# Altium project AX5243_module.PrjPcb
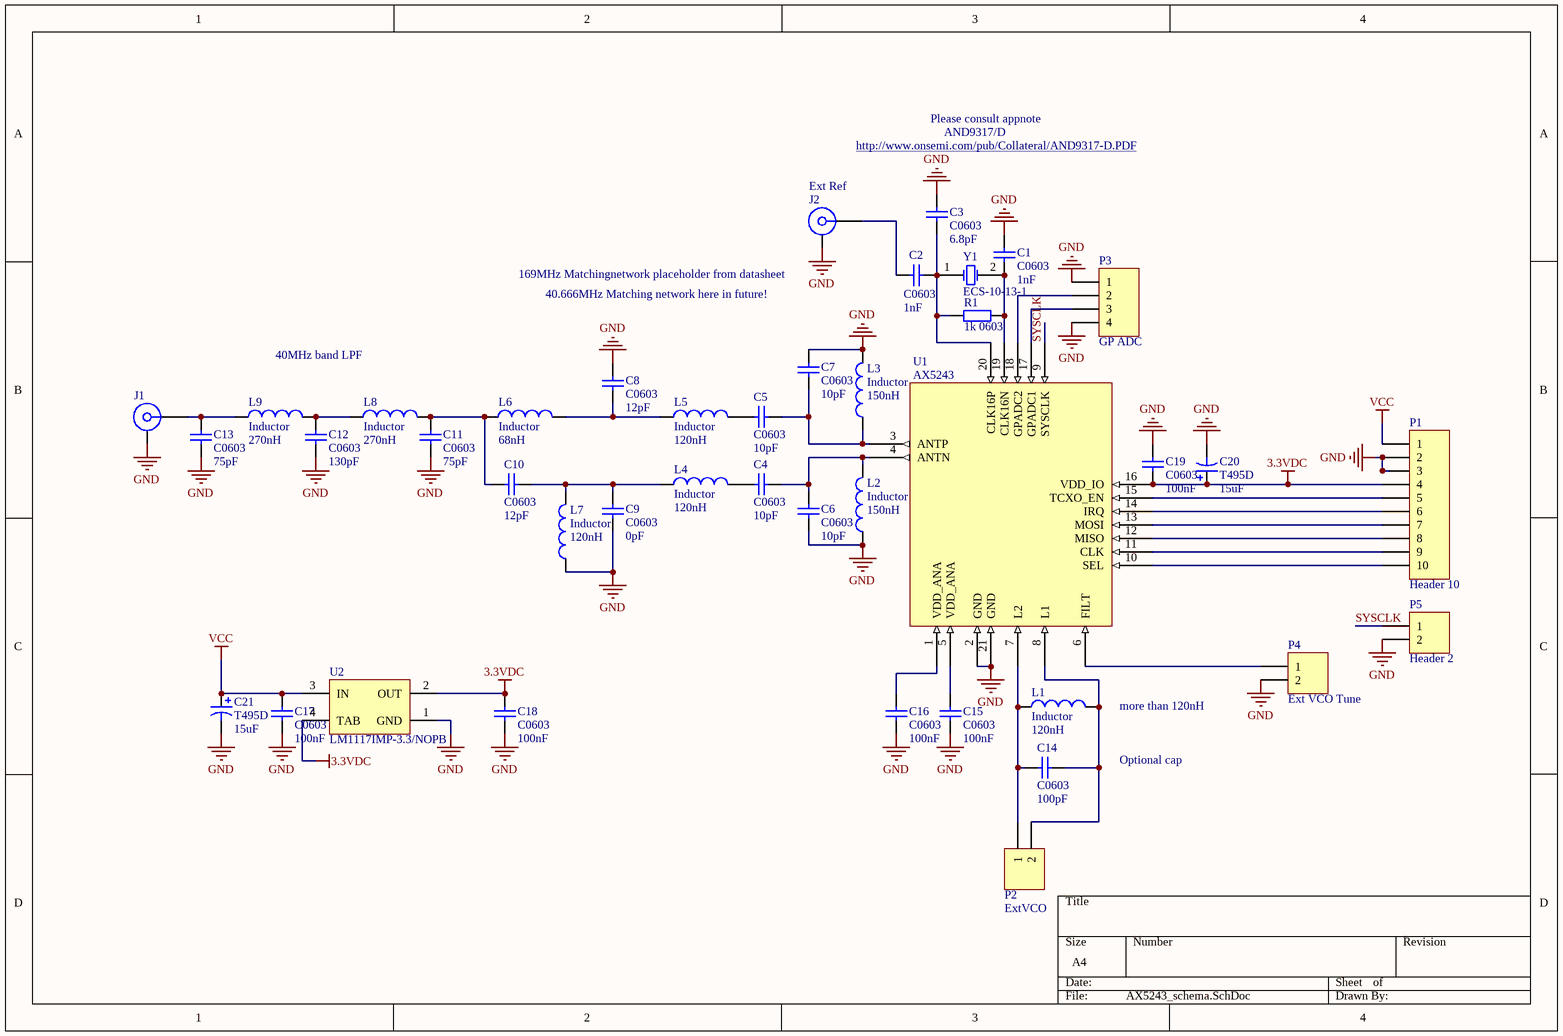
[diagram p0: AX5243_schema.SchDoc]
1 sheet, 41 parts. Net scope: global (net labels, ports and power ports of the same name join across sheets).
Board file: AX5243_module_pcb.PcbDoc

## Sheet AX5243_schema.SchDoc: AX5243 40MHz Module
size A4; Date: 24.10.2017; DrawnBy: iv; Organization: FTG Heavy Industries; Revision: 0; SheetNumber: 1; SheetTotal: 1; DocumentName: AX5243 40MHz transceiver module main sheet; ProjectName: AX5243Module

### Parts
C1  C0603  value 1nF  [0603]
C2  C0603  value 1nF  [0603]
C3  C0603  value 6.8pF  [0603]
C4  C0603  value 10pF  [0603]
C5  C0603  value 10pF  [0603]
C6  C0603  value 10pF  [0603]
C7  C0603  value 10pF  [0603]
C8  C0603  value 12pF  [0603]
C9  C0603  value 0pF  [0603]
C10  C0603  value 12pF  [0603]
C11  C0603  value 75pF  [0603]
C12  C0603  value 130pF  [0603]
C13  C0603  value 75pF  [0603]
C14  C0603  value 100pF  [0603]
C15  C0603  value 100nF  [0603]
C16  C0603  value 100nF  [0603]
C17  C0603  value 100nF  [0603]
C18  C0603  value 100nF  [0603]
C19  C0603  value 100nF  [0603]
C20  T495D  value 15uF  [D]
C21  T495D  value 15uF  [D]
J1  32K145-400L5  [ROS-32K145-400L5_V]  (value not drawn)
J2  32K10A-40ML5  [ROS-32K10A-40ML5_V]  (value not drawn)
L1  Inductor  value 120nH  [INDC1608L]
L2  Inductor  value 150nH  [INDC1608L]
L3  Inductor  value 150nH  [INDC1608L]
L4  Inductor  value 120nH  [INDC1608L]
L5  Inductor  value 120nH  [INDC1608L]
L6  Inductor  value 68nH  [INDC1608L]
L7  Inductor  value 120nH  [INDC1608L]
L8  Inductor  value 270nH  [INDC1608L]
L9  Inductor  value 270nH  [INDC1608L]
P1  Header 10  [HDR1X10]
P2  ExtVCO  [HDR1X2]
P3  GP ADC  [HDR1X4]
P4  Ext VCO Tune  [HDR1X2]
P5  Header 2  [HDR1X2]
R1  1k 0603  [R0603]
U1  AX5243  [QFN20 4,00x4,00mm ON Semi]
U2  LM1117IMP-3.3/NOPB  [MP04A_N]
Y1  ECS-10-13-1  [HC-49U]

### Nets
3.3VDC: C18.2 C19.1 C20.1 P1.4 U1.16(VDD_IO) U2.2(OUT) U2.4(TAB)
GND: C1.2 C3.2 C6.1 C7.2 C8.1 C9.2 C11.1 C12.1 C13.1 C15.1 C16.1 C17.1 C18.1 C19.2 C20.2 C21.2 J1.MP J2.MP L2.1 L3.2 L7.1 P1.2 P1.3 P3.1 P3.4 P4.2 P5.2 U1.2(GND) U1.21(GND) U2.1(GND)
VCC: C17.2 C21.1 P1.1 U2.3(IN)
SYSCLK: P5.1 U1.9(SYSCLK)
NetC1_1: C1.1 R1.2 U1.19(CLK16N) Y1.2(OSC2)
NetC2_1: C2.1 C3.1 R1.1 U1.20(CLK16P) Y1.1(OSC1)
NetC2_2: C2.2 J2.1
NetC4_1: C4.1 L4.2
NetC4_2: C4.2 C6.2 L2.2 U1.4(ANTN)
NetC5_1: C5.1 L5.2
NetC5_2: C5.2 C7.1 L3.1 U1.3(ANTP)
NetC8_2: C8.2 L5.1 L6.2
NetC9_1: C9.1 C10.2 L4.1 L7.2
NetC10_1: C10.1 C11.2 L6.1 L8.2
NetC12_2: C12.2 L8.1 L9.2
NetC13_2: C13.2 J1.1 L9.1
NetC14_1: C14.1 L1.1 P2.1 U1.7(L2)
NetC14_2: C14.2 L1.2 P2.2 U1.8(L1)
NetC15_2: C15.2 U1.5(VDD_ANA)
NetC16_2: C16.2 U1.1(VDD_ANA)
NetP1_5: P1.5 U1.15(TCXO_EN)
NetP1_6: P1.6 U1.14(IRQ)
NetP1_7: P1.7 U1.13(MOSI)
NetP1_8: P1.8 U1.12(MISO)
NetP1_9: P1.9 U1.11(CLK)
NetP1_10: P1.10 U1.10(SEL)
NetP3_2: P3.2 U1.18(GPADC2)
NetP3_3: P3.3 U1.17(GPADC1)
NetP4_1: P4.1 U1.6(FILT)

### Notes on the sheet
- http://www.onsemi.com/pub/Collateral/AND9317-D.PDF
- Please consult appnote
- AND9317/D
- (near J2) Ext Ref
- (near J2) 169MHz Matchingnetwork placeholder from datasheet
- 40.666MHz Matching network here in future!
- 40MHz band LPF
- (near L1) more than 120nH
- Optional cap

### Library data of the parts
C1-C19 = C0603: Ceramic Chip Capacitor - Standard; Note: Footprint corresponds to dimensions for bulk cassette packaging. This case size has tightened tolerances.; Published: 17-Jul-2002; LatestRevisionDate: 19-Mar-2004; LatestRevisionNote: Silkscreen size reduced.; DatasheetDocument: Mar-2001; PackageDocument: Mar-2001; PackageReference: 0603; Publisher: Altium Limited; Code_JEITA: 0603; Code_IPC: 1608 [0603]; ComponentLink1Description: Manufacturer Link; ComponentLink1URL: http://www.kemet.com/; ComponentLink2Description: Datasheet; ComponentLink2URL: http://www.kemet.com/kemet/web/homepage/kechome.nsf/vapubfilesname/F3102TA.pdf/$file/F3102TA.pdf
C20 C21 = T495D: Solid Tantalum Chip Capacitor, Standard T495 Series - Low ESR, Surge Robust; Published: 17-Jul-2002; LatestRevisionDate: 19-Mar-2004; LatestRevisionNote: Silkscreen dimensions re-sized.; DatasheetDocument: Mar-2001; PackageDocument: Mar-2001; PackageReference: D; Publisher: Altium Limited; Code_JEITA: 7343-31; ComponentLink1Description: Manufacturer Link; ComponentLink1URL: http://www.kemet.com/; ComponentLink2Description: Datasheet; ComponentLink2URL: http://www.kemet.com/kemet/web/homepage/kechome.nsf/vapubfilesname/F3102TA.pdf/$file/F3102TA.pdf
J1 = 32K145-400L5: SMA Right Angle Jack, Edge Mount, Up to 18 GHz, -55 to 155 degC; Design Note 1: Footprint in library is a generic example - only application specific footprint delivers High Performance; Desgin Note 2: For more information about DRC setting, please look at following webpage, http://techdocs.altium.com/display/SCRT/Design+Rule+for+Edge-Mount+Connectors; DatasheetVersion: b00; PackageVersion: b00; PackageReference: 32K145-400L5; PackageDescription: SMA Right Angle Jack, Edge Mount, 14.25 x 9.5 x 4.46 mm; Mounting Technology: Surface Mount; PartNumber: 32K145-400L5; ComponentLink1Description: Manufacturer URL; ComponentLink1URL: http://www.rosenberger.de; ComponentLink2Description: Datasheet; ComponentLink2URL: http://rosenberger.de/ok/images/documents/db/32K145-400L5.pdf; ComponentLink3Description: Package Specification; ComponentLink3URL: http://rosenberger.de/ok/images/documents/db/32K145-400L5.pdf; ComponentLink4Description: Series Overview / Design Note; ComponentLink4URL: http://rosenberger.de/ok/images/documents/spez/32.pdf; ComponentLink5Description: Webshop / RFQ; ComponentLink5URL: http://www.rosenberger.com/en/contact/sales/
J2 = 32K10A-40ML5: SMA Straight Jack, Up to 12.4 GHz, -55 to 155 degC; Design Note: Footprint in library is a generic example - only application specific footprint delivers High Performance; DatasheetVersion: e00; PackageVersion: e00; PackageReference: 32K10A-40ML5; PackageDescription: SMA Straight Jack, Press-Fit, 6.35 x 6.35 x 9.5 mm; Mounting Technology: Surface Mount; PartNumber: 32K10A-40ML5; ComponentLink1Description: Manufacturer URL; ComponentLink1URL: http://www.rosenberger.de; ComponentLink2Description: Datasheet; ComponentLink2URL: http://rosenberger.de/ok/images/documents/db/32K10A-40ML5.pdf; ComponentLink3Description: Package Specification; ComponentLink3URL: http://rosenberger.de/ok/images/documents/db/32K10A-40ML5.pdf; ComponentLink4Description: Series Overview / Design Note; ComponentLink4URL: http://rosenberger.de/ok/images/documents/spez/32.pdf; ComponentLink5Description: Webshop / RFQ; ComponentLink5URL: http://www.rosenberger.com/en/contact/sales/
L1-L9 = Inductor: Code_IEC: 1005; Published: 8-Jun-2000; LatestRevisionDate: 29-May-2009; LatestRevisionNote: IPC-7351 Footprint Added.; PackageReference: 0402-A; Publisher: Altium Limited; PackageDescription: Chip Inductor; Code_JEITA: 0402
P1 = Header 10: Header, 10-Pin; LatestRevisionDate: 17-Jul-2002; LatestRevisionNote: Re-released for DXP Platform.; Publisher: Altium Limited
P2 P4 P5 = Header 2: Header, 2-Pin; LatestRevisionDate: 17-Jul-2002; LatestRevisionNote: Re-released for DXP Platform.; Publisher: Altium Limited
P3 = Header 4: Header, 4-Pin; LatestRevisionDate: 17-Jul-2002; LatestRevisionNote: Re-released for DXP Platform.; Publisher: Altium Limited
U1 = AX5243: Data Tranceiver 27-1050MHz; Frequency: 27MHz; Data Rate: 125Kbps; Sensitivity: -137dBm; Interface: SPI; Current - Receiving: 11mA; Current - Transmitting: 48mA; Max Frequency: 1.05GHz; Min Supply Voltage: 1.8V; Max Supply Voltage: 3.6V; Supplier 1: Mouser; Supplier 2: Digi-Key; Manufacturer 2: ON Semiconductor; Manufacturer Part Number 2: AX5243-1-TA05; Stock 2: 0; Pricing 2: 1=2.34, 10=2.117, 100=1.701 (USD); Mount: Surface Mount; Case/Package: QFN; Number of Pins: 20; Min Operating Temperature: -40°C; Max Operating Temperature: 85°C; Packaging: Tape and Reel; Lead Free: Lead Free; REACH SVHC: No SVHC; ComponentLink1URL: http://www.onsemi.com/pub/Collateral/AX5243-D.PDF; ComponentLink1Description: http://www.onsemi.com/pub/Collateral/AX5243-D.PDF; ComponentLink2URL: http://www.farnell.com/datasheets/2009300.pdf; ComponentLink2Description: http://www.farnell.com/datasheets/2009300.pdf; Supplier Part Number 1: 863-AX5243-1-TA05; Supplier Part Number 2: AX5243-1-TA05OSCT-ND
U2 = LM1117IMP-3.3/NOPB: 800mA Low-Dropout Linear Regulator, 4-pin SOT-223, Pb-Free; Manufacturer: National Semiconductor; PackageTopMarking: XYTT*N05B; PowerWise: N; CompType: LDO IC; High-Reliability: Y; DatasheetVersion: Apr-2006; PackageVersion: revB, Apr-2003; PackageReference: MP04A; PackageDescription: Molded SOT-223, 6.50 x 3.56 x 1.6mm Body, 4 Lead, 2.3mm Pitch; PartNumber: LM1117IMP-3.3/NOPB; RoHS: Y; PinCount: 4; Code_JEDEC: TO-261-AA; Code_IPC: SOT223-4; ComponentLink1Description: Manufacturer URL; ComponentLink1URL: http://www.national.com/; ComponentLink2Description: LM1117 Datasheet; ComponentLink2URL: http://www.national.com/ds/LM/LM1117.pdf; ComponentLink3Description: LM1117 Web Page; ComponentLink3URL: http://www.national.com/pf/LM/LM1117.html; ComponentLink4Description: MP04A Package Page; ComponentLink4URL: http://www.national.com/packaging/folders/mp04a.html
Y1 = ECS-10-13-1: Crystal Oscillator; Published: 17-Jul-2002; DatasheetDocument: 18-Apr-2000; PackageReference: HC-49U; Publisher: Altium Limited; ComponentLink1Description: Manufacturer Link; ComponentLink1URL: http://www.ecsxtal.com/; ComponentLink2Description: Datasheet; ComponentLink2URL: http://www.ecsxtal.com/pdf2/HC49U.PDF